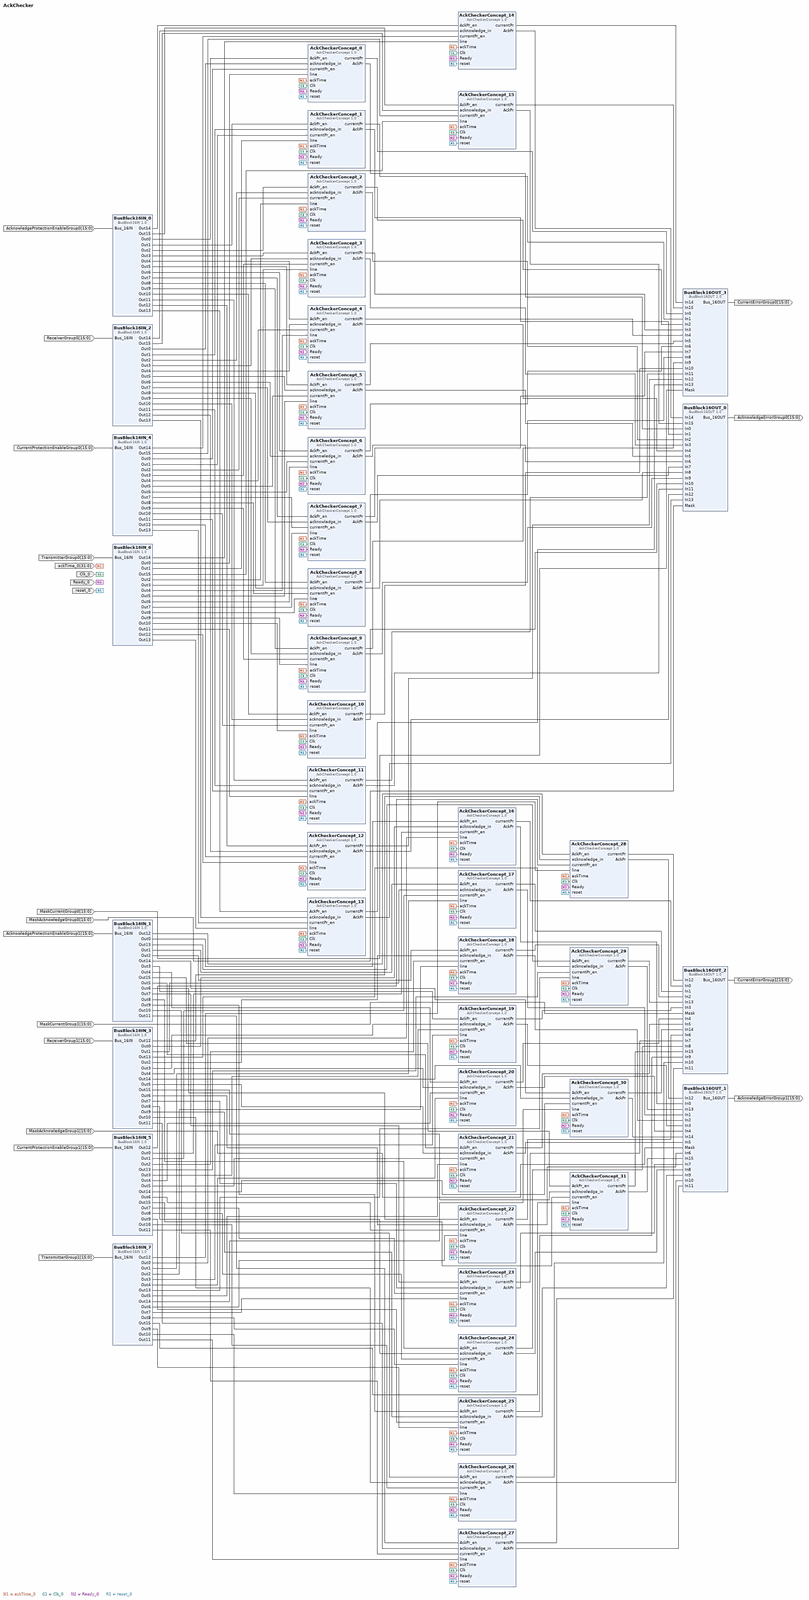
[diagram p0: block diagram of the top level, whole]
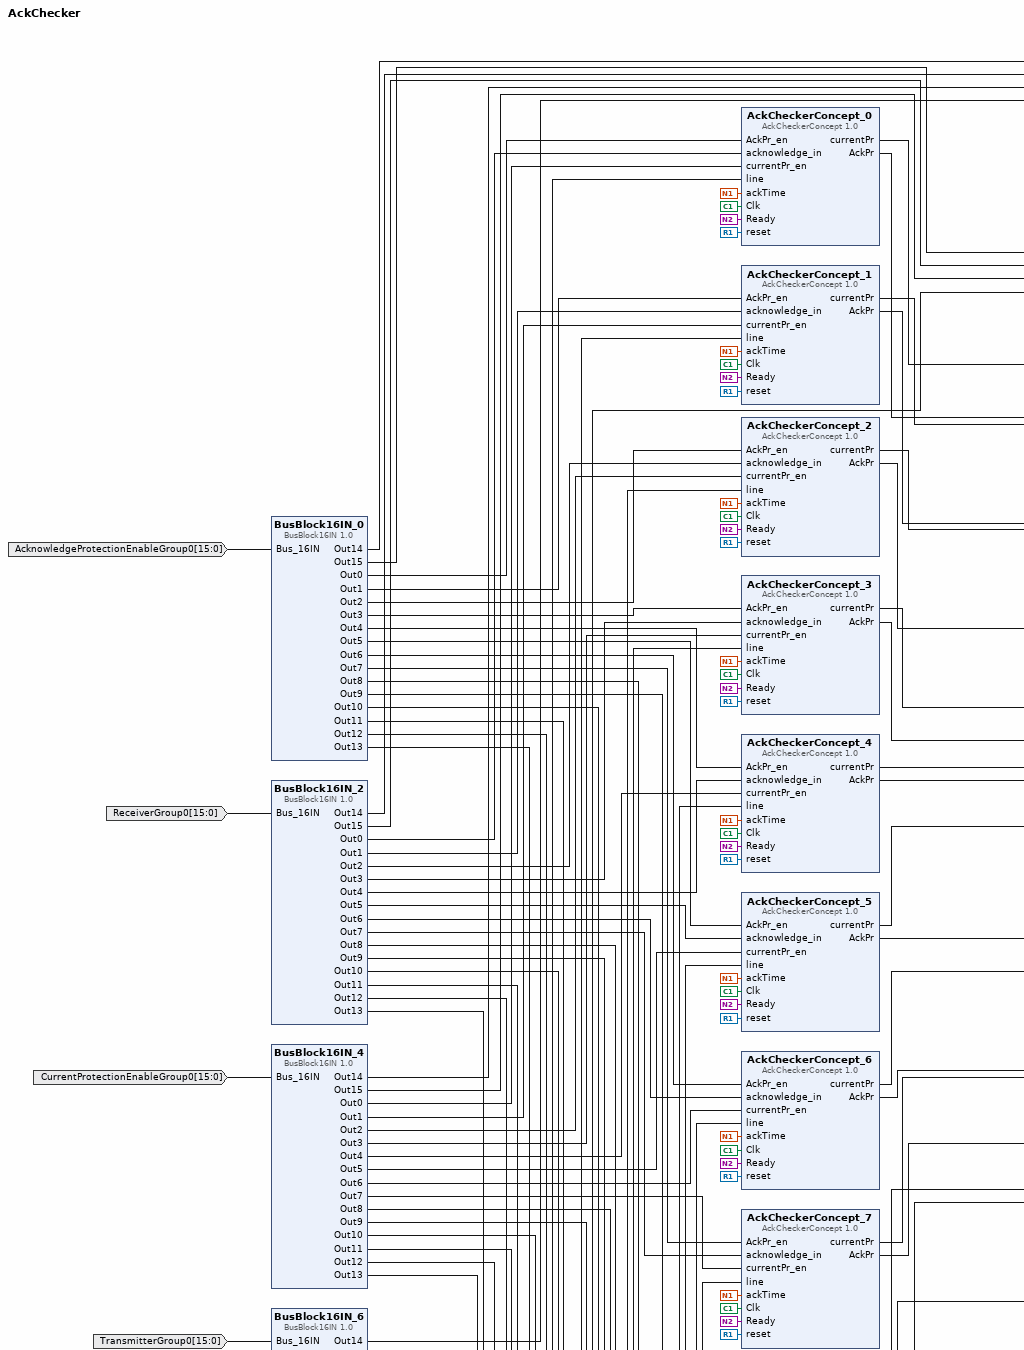
[diagram p1: block diagram of the top level, upper left part]
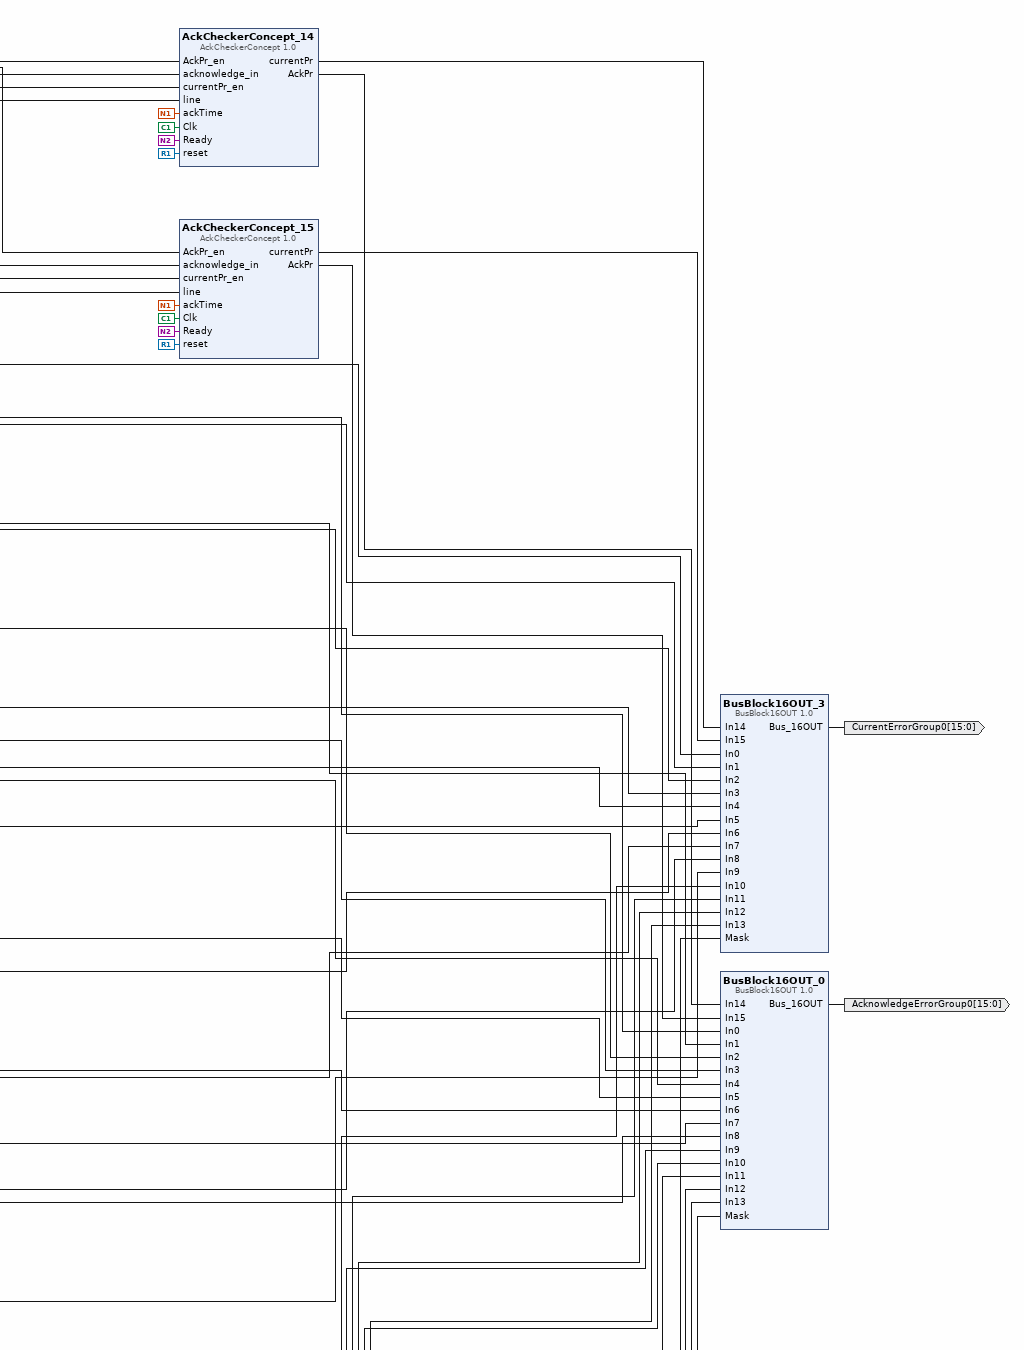
[diagram p2: block diagram of the top level, upper right part]
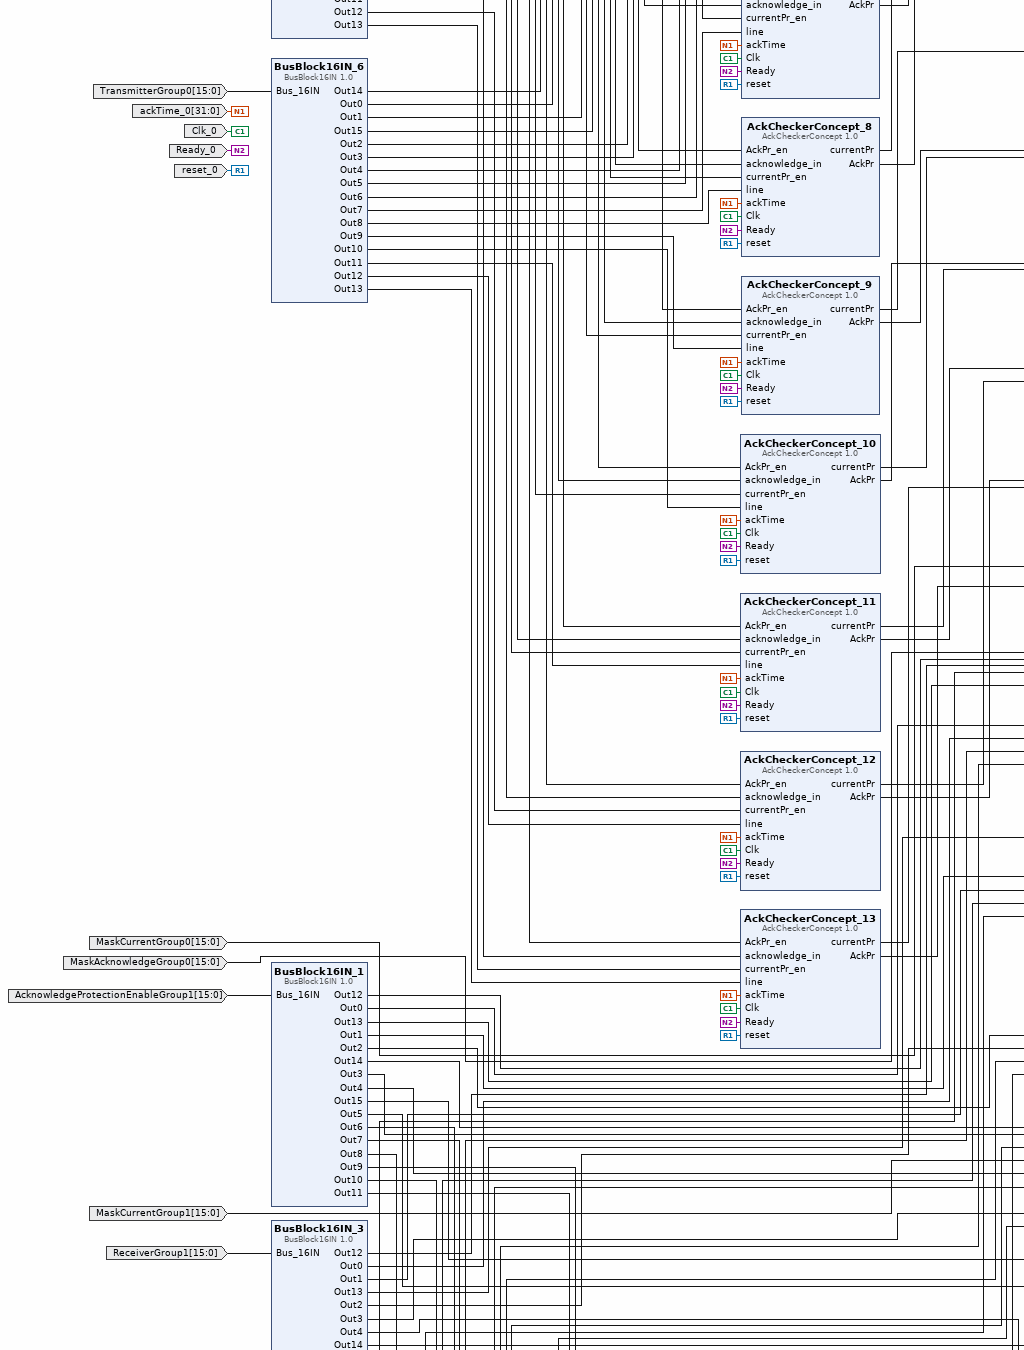
[diagram p3: block diagram of the top level, middle left part]
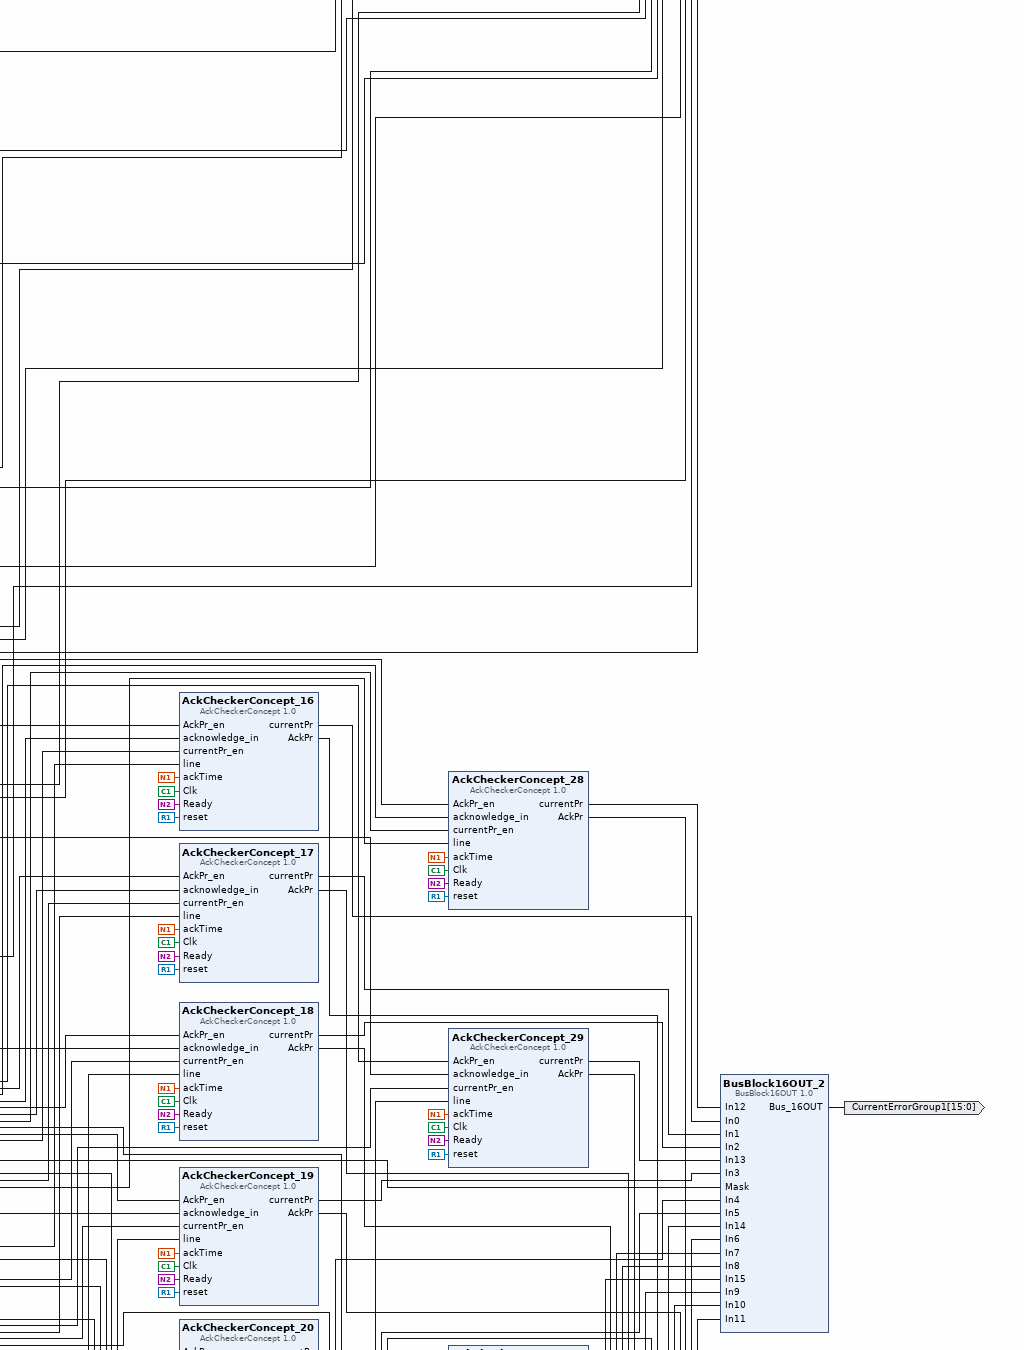
[diagram p4: block diagram of the top level, middle right part]
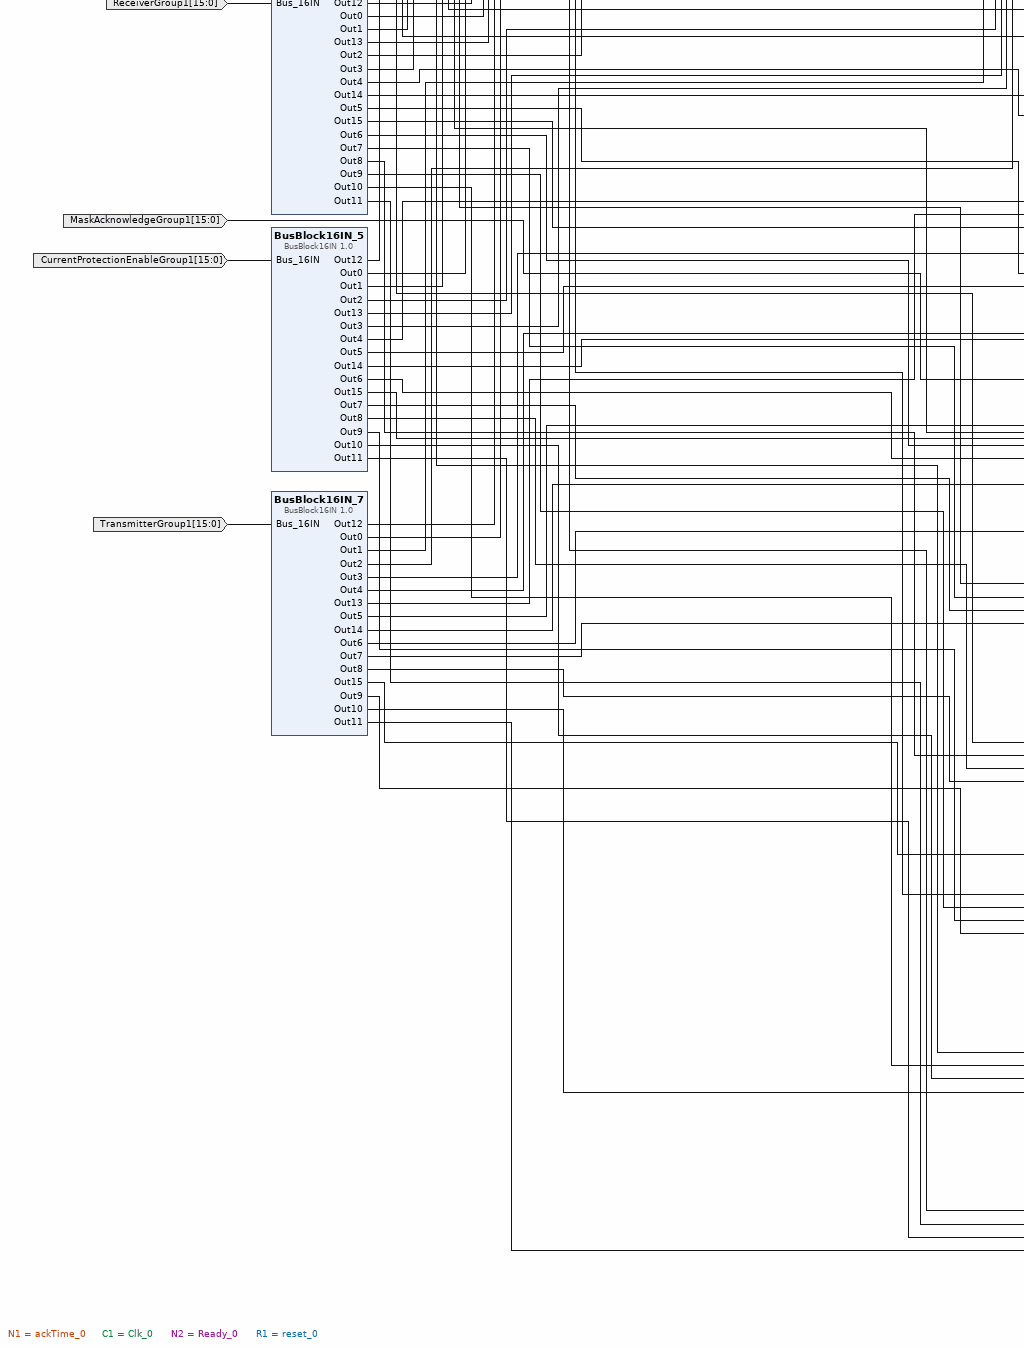
[diagram p5: block diagram of the top level, lower left part]
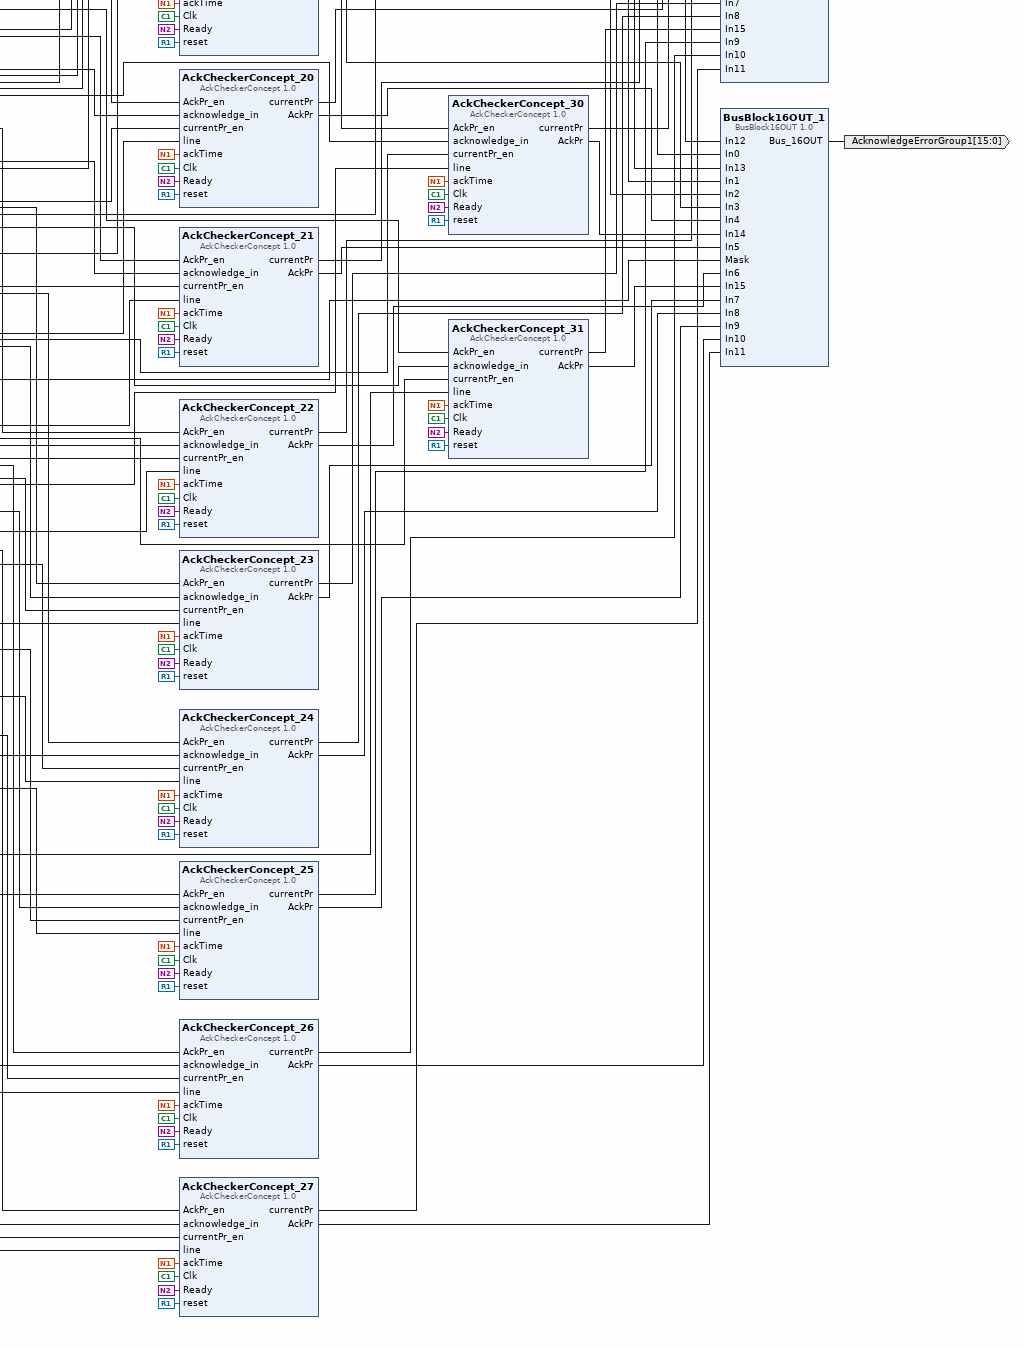
[diagram p6: block diagram of the top level, lower right part]
# Vivado block design AckChecker, xc7z020clg484-3, Vivado 2019.1
create_bd_design AckChecker

create_bd_port -dir I -from 31 -to 0 ackTime_0
create_bd_port -dir I -type clk Clk_0
create_bd_port -dir I Ready_0
create_bd_port -dir I -type rst reset_0
create_bd_port -dir O -from 15 -to 0 AcknowledgeErrorGroup0
create_bd_port -dir O -from 15 -to 0 AcknowledgeErrorGroup1
create_bd_port -dir O -from 15 -to 0 CurrentErrorGroup0
create_bd_port -dir O -from 15 -to 0 CurrentErrorGroup1
create_bd_port -dir I -from 15 -to 0 MaskAcknowledgeGroup0
create_bd_port -dir I -from 15 -to 0 MaskAcknowledgeGroup1
create_bd_port -dir I -from 15 -to 0 MaskCurrentGroup0
create_bd_port -dir I -from 15 -to 0 MaskCurrentGroup1
create_bd_port -dir I -from 15 -to 0 AcknowledgeProtectionEnableGroup0
create_bd_port -dir I -from 15 -to 0 AcknowledgeProtectionEnableGroup1
create_bd_port -dir I -from 15 -to 0 ReceiverGroup0
create_bd_port -dir I -from 15 -to 0 ReceiverGroup1
create_bd_port -dir I -from 15 -to 0 CurrentProtectionEnableGroup0
create_bd_port -dir I -from 15 -to 0 CurrentProtectionEnableGroup1
create_bd_port -dir I -from 15 -to 0 TransmitterGroup0
create_bd_port -dir I -from 15 -to 0 TransmitterGroup1

create_bd_cell -type ip -vlnv ssevendenergy.com:user:AckCheckerConcept:1.0 AckCheckerConcept_0
create_bd_cell -type ip -vlnv ssevendenergy.com:user:AckCheckerConcept:1.0 AckCheckerConcept_1
create_bd_cell -type ip -vlnv ssevendenergy.com:user:AckCheckerConcept:1.0 AckCheckerConcept_2
create_bd_cell -type ip -vlnv ssevendenergy.com:user:AckCheckerConcept:1.0 AckCheckerConcept_3
create_bd_cell -type ip -vlnv ssevendenergy.com:user:AckCheckerConcept:1.0 AckCheckerConcept_4
create_bd_cell -type ip -vlnv ssevendenergy.com:user:AckCheckerConcept:1.0 AckCheckerConcept_5
create_bd_cell -type ip -vlnv ssevendenergy.com:user:AckCheckerConcept:1.0 AckCheckerConcept_6
create_bd_cell -type ip -vlnv ssevendenergy.com:user:AckCheckerConcept:1.0 AckCheckerConcept_7
create_bd_cell -type ip -vlnv ssevendenergy.com:user:AckCheckerConcept:1.0 AckCheckerConcept_8
create_bd_cell -type ip -vlnv ssevendenergy.com:user:AckCheckerConcept:1.0 AckCheckerConcept_9
create_bd_cell -type ip -vlnv ssevendenergy.com:user:AckCheckerConcept:1.0 AckCheckerConcept_10
create_bd_cell -type ip -vlnv ssevendenergy.com:user:AckCheckerConcept:1.0 AckCheckerConcept_11
create_bd_cell -type ip -vlnv ssevendenergy.com:user:AckCheckerConcept:1.0 AckCheckerConcept_12
create_bd_cell -type ip -vlnv ssevendenergy.com:user:AckCheckerConcept:1.0 AckCheckerConcept_13
create_bd_cell -type ip -vlnv ssevendenergy.com:user:AckCheckerConcept:1.0 AckCheckerConcept_14
create_bd_cell -type ip -vlnv ssevendenergy.com:user:AckCheckerConcept:1.0 AckCheckerConcept_15
create_bd_cell -type ip -vlnv ssevendenergy.com:user:AckCheckerConcept:1.0 AckCheckerConcept_16
create_bd_cell -type ip -vlnv ssevendenergy.com:user:AckCheckerConcept:1.0 AckCheckerConcept_17
create_bd_cell -type ip -vlnv ssevendenergy.com:user:AckCheckerConcept:1.0 AckCheckerConcept_18
create_bd_cell -type ip -vlnv ssevendenergy.com:user:AckCheckerConcept:1.0 AckCheckerConcept_19
create_bd_cell -type ip -vlnv ssevendenergy.com:user:AckCheckerConcept:1.0 AckCheckerConcept_20
create_bd_cell -type ip -vlnv ssevendenergy.com:user:AckCheckerConcept:1.0 AckCheckerConcept_21
create_bd_cell -type ip -vlnv ssevendenergy.com:user:AckCheckerConcept:1.0 AckCheckerConcept_22
create_bd_cell -type ip -vlnv ssevendenergy.com:user:AckCheckerConcept:1.0 AckCheckerConcept_23
create_bd_cell -type ip -vlnv ssevendenergy.com:user:AckCheckerConcept:1.0 AckCheckerConcept_24
create_bd_cell -type ip -vlnv ssevendenergy.com:user:AckCheckerConcept:1.0 AckCheckerConcept_25
create_bd_cell -type ip -vlnv ssevendenergy.com:user:AckCheckerConcept:1.0 AckCheckerConcept_26
create_bd_cell -type ip -vlnv ssevendenergy.com:user:AckCheckerConcept:1.0 AckCheckerConcept_27
create_bd_cell -type ip -vlnv ssevendenergy.com:user:AckCheckerConcept:1.0 AckCheckerConcept_28
create_bd_cell -type ip -vlnv ssevendenergy.com:user:AckCheckerConcept:1.0 AckCheckerConcept_29
create_bd_cell -type ip -vlnv ssevendenergy.com:user:AckCheckerConcept:1.0 AckCheckerConcept_30
create_bd_cell -type ip -vlnv ssevendenergy.com:user:AckCheckerConcept:1.0 AckCheckerConcept_31
create_bd_cell -type ip -vlnv ssevendenergy.com:user:BusBlock16OUT:1.0 BusBlock16OUT_0
create_bd_cell -type ip -vlnv ssevendenergy.com:user:BusBlock16OUT:1.0 BusBlock16OUT_1
create_bd_cell -type ip -vlnv ssevendenergy.com:user:BusBlock16OUT:1.0 BusBlock16OUT_2
create_bd_cell -type ip -vlnv ssevendenergy.com:user:BusBlock16OUT:1.0 BusBlock16OUT_3
create_bd_cell -type ip -vlnv ssevendenergy.com:user:BusBlock16IN:1.0 BusBlock16IN_0
create_bd_cell -type ip -vlnv ssevendenergy.com:user:BusBlock16IN:1.0 BusBlock16IN_1
create_bd_cell -type ip -vlnv ssevendenergy.com:user:BusBlock16IN:1.0 BusBlock16IN_2
create_bd_cell -type ip -vlnv ssevendenergy.com:user:BusBlock16IN:1.0 BusBlock16IN_4
create_bd_cell -type ip -vlnv ssevendenergy.com:user:BusBlock16IN:1.0 BusBlock16IN_3
create_bd_cell -type ip -vlnv ssevendenergy.com:user:BusBlock16IN:1.0 BusBlock16IN_5
create_bd_cell -type ip -vlnv ssevendenergy.com:user:BusBlock16IN:1.0 BusBlock16IN_6
create_bd_cell -type ip -vlnv ssevendenergy.com:user:BusBlock16IN:1.0 BusBlock16IN_7

# ---- connections ----

connect_bd_net -net ackTime_0_1 [get_bd_ports ackTime_0] \
  [get_bd_pins AckCheckerConcept_0/ackTime] [get_bd_pins AckCheckerConcept_1/ackTime] \
  [get_bd_pins AckCheckerConcept_4/ackTime] [get_bd_pins AckCheckerConcept_5/ackTime] \
  [get_bd_pins AckCheckerConcept_2/ackTime] [get_bd_pins AckCheckerConcept_6/ackTime] \
  [get_bd_pins AckCheckerConcept_3/ackTime] [get_bd_pins AckCheckerConcept_7/ackTime] \
  [get_bd_pins AckCheckerConcept_8/ackTime] [get_bd_pins AckCheckerConcept_9/ackTime] \
  [get_bd_pins AckCheckerConcept_10/ackTime] [get_bd_pins AckCheckerConcept_11/ackTime] \
  [get_bd_pins AckCheckerConcept_12/ackTime] [get_bd_pins AckCheckerConcept_13/ackTime] \
  [get_bd_pins AckCheckerConcept_14/ackTime] [get_bd_pins AckCheckerConcept_15/ackTime] \
  [get_bd_pins AckCheckerConcept_16/ackTime] [get_bd_pins AckCheckerConcept_17/ackTime] \
  [get_bd_pins AckCheckerConcept_18/ackTime] [get_bd_pins AckCheckerConcept_19/ackTime] \
  [get_bd_pins AckCheckerConcept_20/ackTime] [get_bd_pins AckCheckerConcept_21/ackTime] \
  [get_bd_pins AckCheckerConcept_22/ackTime] [get_bd_pins AckCheckerConcept_23/ackTime] \
  [get_bd_pins AckCheckerConcept_24/ackTime] [get_bd_pins AckCheckerConcept_26/ackTime] \
  [get_bd_pins AckCheckerConcept_27/ackTime] [get_bd_pins AckCheckerConcept_28/ackTime] \
  [get_bd_pins AckCheckerConcept_29/ackTime] [get_bd_pins AckCheckerConcept_30/ackTime] \
  [get_bd_pins AckCheckerConcept_31/ackTime] [get_bd_pins AckCheckerConcept_25/ackTime]
connect_bd_net -net Clk_0_1 [get_bd_ports Clk_0] \
  [get_bd_pins AckCheckerConcept_0/Clk] [get_bd_pins AckCheckerConcept_4/Clk] [get_bd_pins AckCheckerConcept_1/Clk] \
  [get_bd_pins AckCheckerConcept_5/Clk] [get_bd_pins AckCheckerConcept_2/Clk] [get_bd_pins AckCheckerConcept_6/Clk] \
  [get_bd_pins AckCheckerConcept_3/Clk] [get_bd_pins AckCheckerConcept_7/Clk] [get_bd_pins AckCheckerConcept_11/Clk] \
  [get_bd_pins AckCheckerConcept_10/Clk] [get_bd_pins AckCheckerConcept_9/Clk] [get_bd_pins AckCheckerConcept_8/Clk] \
  [get_bd_pins AckCheckerConcept_12/Clk] [get_bd_pins AckCheckerConcept_13/Clk] [get_bd_pins AckCheckerConcept_14/Clk] \
  [get_bd_pins AckCheckerConcept_15/Clk] [get_bd_pins AckCheckerConcept_16/Clk] [get_bd_pins AckCheckerConcept_17/Clk] \
  [get_bd_pins AckCheckerConcept_18/Clk] [get_bd_pins AckCheckerConcept_19/Clk] [get_bd_pins AckCheckerConcept_23/Clk] \
  [get_bd_pins AckCheckerConcept_22/Clk] [get_bd_pins AckCheckerConcept_21/Clk] [get_bd_pins AckCheckerConcept_20/Clk] \
  [get_bd_pins AckCheckerConcept_24/Clk] [get_bd_pins AckCheckerConcept_25/Clk] [get_bd_pins AckCheckerConcept_26/Clk] \
  [get_bd_pins AckCheckerConcept_27/Clk] [get_bd_pins AckCheckerConcept_31/Clk] [get_bd_pins AckCheckerConcept_30/Clk] \
  [get_bd_pins AckCheckerConcept_29/Clk] [get_bd_pins AckCheckerConcept_28/Clk]
connect_bd_net -net Ready_0_1 [get_bd_ports Ready_0] \
  [get_bd_pins AckCheckerConcept_0/Ready] [get_bd_pins AckCheckerConcept_1/Ready] [get_bd_pins AckCheckerConcept_2/Ready] \
  [get_bd_pins AckCheckerConcept_3/Ready] [get_bd_pins AckCheckerConcept_4/Ready] [get_bd_pins AckCheckerConcept_5/Ready] \
  [get_bd_pins AckCheckerConcept_6/Ready] [get_bd_pins AckCheckerConcept_7/Ready] [get_bd_pins AckCheckerConcept_11/Ready] \
  [get_bd_pins AckCheckerConcept_10/Ready] [get_bd_pins AckCheckerConcept_9/Ready] [get_bd_pins AckCheckerConcept_8/Ready] \
  [get_bd_pins AckCheckerConcept_12/Ready] [get_bd_pins AckCheckerConcept_13/Ready] [get_bd_pins AckCheckerConcept_14/Ready] \
  [get_bd_pins AckCheckerConcept_15/Ready] [get_bd_pins AckCheckerConcept_16/Ready] [get_bd_pins AckCheckerConcept_17/Ready] \
  [get_bd_pins AckCheckerConcept_18/Ready] [get_bd_pins AckCheckerConcept_19/Ready] [get_bd_pins AckCheckerConcept_23/Ready] \
  [get_bd_pins AckCheckerConcept_22/Ready] [get_bd_pins AckCheckerConcept_21/Ready] [get_bd_pins AckCheckerConcept_20/Ready] \
  [get_bd_pins AckCheckerConcept_24/Ready] [get_bd_pins AckCheckerConcept_25/Ready] [get_bd_pins AckCheckerConcept_26/Ready] \
  [get_bd_pins AckCheckerConcept_27/Ready] [get_bd_pins AckCheckerConcept_31/Ready] [get_bd_pins AckCheckerConcept_30/Ready] \
  [get_bd_pins AckCheckerConcept_29/Ready] [get_bd_pins AckCheckerConcept_28/Ready]
connect_bd_net -net reset_0_1 [get_bd_ports reset_0] \
  [get_bd_pins AckCheckerConcept_0/reset] [get_bd_pins AckCheckerConcept_1/reset] [get_bd_pins AckCheckerConcept_2/reset] \
  [get_bd_pins AckCheckerConcept_3/reset] [get_bd_pins AckCheckerConcept_7/reset] [get_bd_pins AckCheckerConcept_6/reset] \
  [get_bd_pins AckCheckerConcept_5/reset] [get_bd_pins AckCheckerConcept_4/reset] [get_bd_pins AckCheckerConcept_8/reset] \
  [get_bd_pins AckCheckerConcept_9/reset] [get_bd_pins AckCheckerConcept_10/reset] [get_bd_pins AckCheckerConcept_11/reset] \
  [get_bd_pins AckCheckerConcept_14/reset] [get_bd_pins AckCheckerConcept_15/reset] [get_bd_pins AckCheckerConcept_13/reset] \
  [get_bd_pins AckCheckerConcept_12/reset] [get_bd_pins AckCheckerConcept_19/reset] [get_bd_pins AckCheckerConcept_18/reset] \
  [get_bd_pins AckCheckerConcept_17/reset] [get_bd_pins AckCheckerConcept_16/reset] [get_bd_pins AckCheckerConcept_20/reset] \
  [get_bd_pins AckCheckerConcept_21/reset] [get_bd_pins AckCheckerConcept_22/reset] [get_bd_pins AckCheckerConcept_23/reset] \
  [get_bd_pins AckCheckerConcept_27/reset] [get_bd_pins AckCheckerConcept_26/reset] [get_bd_pins AckCheckerConcept_25/reset] \
  [get_bd_pins AckCheckerConcept_24/reset] [get_bd_pins AckCheckerConcept_28/reset] [get_bd_pins AckCheckerConcept_29/reset] \
  [get_bd_pins AckCheckerConcept_30/reset] [get_bd_pins AckCheckerConcept_31/reset]
connect_bd_net [get_bd_pins AckCheckerConcept_0/AckPr] [get_bd_pins BusBlock16OUT_0/In0]
connect_bd_net [get_bd_pins AckCheckerConcept_1/AckPr] [get_bd_pins BusBlock16OUT_0/In1]
connect_bd_net [get_bd_pins AckCheckerConcept_2/AckPr] [get_bd_pins BusBlock16OUT_0/In2]
connect_bd_net [get_bd_pins AckCheckerConcept_3/AckPr] [get_bd_pins BusBlock16OUT_0/In3]
connect_bd_net [get_bd_pins AckCheckerConcept_4/AckPr] [get_bd_pins BusBlock16OUT_0/In4]
connect_bd_net [get_bd_pins AckCheckerConcept_5/AckPr] [get_bd_pins BusBlock16OUT_0/In5]
connect_bd_net [get_bd_pins AckCheckerConcept_6/AckPr] [get_bd_pins BusBlock16OUT_0/In6]
connect_bd_net [get_bd_pins AckCheckerConcept_7/AckPr] [get_bd_pins BusBlock16OUT_0/In7]
connect_bd_net [get_bd_pins AckCheckerConcept_8/AckPr] [get_bd_pins BusBlock16OUT_0/In8]
connect_bd_net [get_bd_pins AckCheckerConcept_9/AckPr] [get_bd_pins BusBlock16OUT_0/In9]
connect_bd_net [get_bd_pins AckCheckerConcept_10/AckPr] [get_bd_pins BusBlock16OUT_0/In10]
connect_bd_net [get_bd_pins AckCheckerConcept_11/AckPr] [get_bd_pins BusBlock16OUT_0/In11]
connect_bd_net [get_bd_pins AckCheckerConcept_12/AckPr] [get_bd_pins BusBlock16OUT_0/In12]
connect_bd_net [get_bd_pins AckCheckerConcept_13/AckPr] [get_bd_pins BusBlock16OUT_0/In13]
connect_bd_net [get_bd_pins AckCheckerConcept_14/AckPr] [get_bd_pins BusBlock16OUT_0/In14]
connect_bd_net [get_bd_pins AckCheckerConcept_15/AckPr] [get_bd_pins BusBlock16OUT_0/In15]
connect_bd_net [get_bd_pins AckCheckerConcept_16/AckPr] [get_bd_pins BusBlock16OUT_1/In0]
connect_bd_net [get_bd_pins AckCheckerConcept_17/AckPr] [get_bd_pins BusBlock16OUT_1/In1]
connect_bd_net [get_bd_pins AckCheckerConcept_18/AckPr] [get_bd_pins BusBlock16OUT_1/In2]
connect_bd_net [get_bd_pins AckCheckerConcept_19/AckPr] [get_bd_pins BusBlock16OUT_1/In3]
connect_bd_net [get_bd_pins AckCheckerConcept_20/AckPr] [get_bd_pins BusBlock16OUT_1/In4]
connect_bd_net [get_bd_pins AckCheckerConcept_21/AckPr] [get_bd_pins BusBlock16OUT_1/In5]
connect_bd_net [get_bd_pins AckCheckerConcept_22/AckPr] [get_bd_pins BusBlock16OUT_1/In6]
connect_bd_net [get_bd_pins AckCheckerConcept_23/AckPr] [get_bd_pins BusBlock16OUT_1/In7]
connect_bd_net [get_bd_pins AckCheckerConcept_24/AckPr] [get_bd_pins BusBlock16OUT_1/In8]
connect_bd_net [get_bd_pins AckCheckerConcept_25/AckPr] [get_bd_pins BusBlock16OUT_1/In9]
connect_bd_net [get_bd_pins AckCheckerConcept_26/AckPr] [get_bd_pins BusBlock16OUT_1/In10]
connect_bd_net [get_bd_pins AckCheckerConcept_27/AckPr] [get_bd_pins BusBlock16OUT_1/In11]
connect_bd_net [get_bd_pins AckCheckerConcept_28/AckPr] [get_bd_pins BusBlock16OUT_1/In12]
connect_bd_net [get_bd_pins AckCheckerConcept_29/AckPr] [get_bd_pins BusBlock16OUT_1/In13]
connect_bd_net [get_bd_pins AckCheckerConcept_30/AckPr] [get_bd_pins BusBlock16OUT_1/In14]
connect_bd_net [get_bd_pins AckCheckerConcept_31/AckPr] [get_bd_pins BusBlock16OUT_1/In15]
connect_bd_net [get_bd_pins AckCheckerConcept_0/currentPr] [get_bd_pins BusBlock16OUT_3/In0]
connect_bd_net [get_bd_pins AckCheckerConcept_1/currentPr] [get_bd_pins BusBlock16OUT_3/In1]
connect_bd_net [get_bd_pins AckCheckerConcept_2/currentPr] [get_bd_pins BusBlock16OUT_3/In2]
connect_bd_net [get_bd_pins AckCheckerConcept_3/currentPr] [get_bd_pins BusBlock16OUT_3/In3]
connect_bd_net [get_bd_pins AckCheckerConcept_4/currentPr] [get_bd_pins BusBlock16OUT_3/In4]
connect_bd_net [get_bd_pins AckCheckerConcept_5/currentPr] [get_bd_pins BusBlock16OUT_3/In5]
connect_bd_net [get_bd_pins AckCheckerConcept_6/currentPr] [get_bd_pins BusBlock16OUT_3/In6]
connect_bd_net [get_bd_pins AckCheckerConcept_7/currentPr] [get_bd_pins BusBlock16OUT_3/In7]
connect_bd_net [get_bd_pins AckCheckerConcept_8/currentPr] [get_bd_pins BusBlock16OUT_3/In8]
connect_bd_net [get_bd_pins AckCheckerConcept_9/currentPr] [get_bd_pins BusBlock16OUT_3/In9]
connect_bd_net [get_bd_pins AckCheckerConcept_10/currentPr] [get_bd_pins BusBlock16OUT_3/In10]
connect_bd_net [get_bd_pins AckCheckerConcept_11/currentPr] [get_bd_pins BusBlock16OUT_3/In11]
connect_bd_net [get_bd_pins AckCheckerConcept_12/currentPr] [get_bd_pins BusBlock16OUT_3/In12]
connect_bd_net [get_bd_pins AckCheckerConcept_13/currentPr] [get_bd_pins BusBlock16OUT_3/In13]
connect_bd_net [get_bd_pins AckCheckerConcept_14/currentPr] [get_bd_pins BusBlock16OUT_3/In14]
connect_bd_net [get_bd_pins AckCheckerConcept_15/currentPr] [get_bd_pins BusBlock16OUT_3/In15]
connect_bd_net [get_bd_pins AckCheckerConcept_16/currentPr] [get_bd_pins BusBlock16OUT_2/In0]
connect_bd_net [get_bd_pins AckCheckerConcept_17/currentPr] [get_bd_pins BusBlock16OUT_2/In1]
connect_bd_net [get_bd_pins AckCheckerConcept_18/currentPr] [get_bd_pins BusBlock16OUT_2/In2]
connect_bd_net [get_bd_pins AckCheckerConcept_19/currentPr] [get_bd_pins BusBlock16OUT_2/In3]
connect_bd_net [get_bd_pins AckCheckerConcept_20/currentPr] [get_bd_pins BusBlock16OUT_2/In4]
connect_bd_net [get_bd_pins AckCheckerConcept_21/currentPr] [get_bd_pins BusBlock16OUT_2/In5]
connect_bd_net [get_bd_pins AckCheckerConcept_22/currentPr] [get_bd_pins BusBlock16OUT_2/In6]
connect_bd_net [get_bd_pins AckCheckerConcept_23/currentPr] [get_bd_pins BusBlock16OUT_2/In7]
connect_bd_net [get_bd_pins AckCheckerConcept_24/currentPr] [get_bd_pins BusBlock16OUT_2/In8]
connect_bd_net [get_bd_pins AckCheckerConcept_25/currentPr] [get_bd_pins BusBlock16OUT_2/In9]
connect_bd_net [get_bd_pins AckCheckerConcept_26/currentPr] [get_bd_pins BusBlock16OUT_2/In10]
connect_bd_net [get_bd_pins AckCheckerConcept_27/currentPr] [get_bd_pins BusBlock16OUT_2/In11]
connect_bd_net [get_bd_pins AckCheckerConcept_28/currentPr] [get_bd_pins BusBlock16OUT_2/In12]
connect_bd_net [get_bd_pins AckCheckerConcept_29/currentPr] [get_bd_pins BusBlock16OUT_2/In13]
connect_bd_net [get_bd_pins AckCheckerConcept_30/currentPr] [get_bd_pins BusBlock16OUT_2/In14]
connect_bd_net [get_bd_pins AckCheckerConcept_31/currentPr] [get_bd_pins BusBlock16OUT_2/In15]
connect_bd_net -net BusBlock16OUT_0_BusBlock16OUT [get_bd_pins BusBlock16OUT_0/Bus_16OUT] [get_bd_ports AcknowledgeErrorGroup0]
connect_bd_net -net BusBlock16OUT_1_BusBlock16OUT [get_bd_pins BusBlock16OUT_1/Bus_16OUT] [get_bd_ports AcknowledgeErrorGroup1]
connect_bd_net -net BusBlock16OUT_3_BusBlock16OUT [get_bd_pins BusBlock16OUT_3/Bus_16OUT] [get_bd_ports CurrentErrorGroup0]
connect_bd_net -net BusBlock16OUT_2_BusBlock16OUT [get_bd_pins BusBlock16OUT_2/Bus_16OUT] [get_bd_ports CurrentErrorGroup1]
connect_bd_net -net MaskAcknowledgeGroup0_1 [get_bd_ports MaskAcknowledgeGroup0] [get_bd_pins BusBlock16OUT_0/Mask]
connect_bd_net -net MaskAcknowledgeGroup1_1 [get_bd_ports MaskAcknowledgeGroup1] [get_bd_pins BusBlock16OUT_1/Mask]
connect_bd_net -net MaskCurrentGroup0_1 [get_bd_ports MaskCurrentGroup0] [get_bd_pins BusBlock16OUT_3/Mask]
connect_bd_net -net MaskCurrentGroup1_1 [get_bd_ports MaskCurrentGroup1] [get_bd_pins BusBlock16OUT_2/Mask]
connect_bd_net [get_bd_pins BusBlock16IN_0/Out0] [get_bd_pins AckCheckerConcept_0/AckPr_en]
connect_bd_net [get_bd_pins BusBlock16IN_0/Out1] [get_bd_pins AckCheckerConcept_1/AckPr_en]
connect_bd_net [get_bd_pins BusBlock16IN_0/Out2] [get_bd_pins AckCheckerConcept_2/AckPr_en]
connect_bd_net [get_bd_pins BusBlock16IN_0/Out3] [get_bd_pins AckCheckerConcept_3/AckPr_en]
connect_bd_net [get_bd_pins BusBlock16IN_0/Out4] [get_bd_pins AckCheckerConcept_4/AckPr_en]
connect_bd_net [get_bd_pins BusBlock16IN_0/Out5] [get_bd_pins AckCheckerConcept_5/AckPr_en]
connect_bd_net [get_bd_pins BusBlock16IN_0/Out6] [get_bd_pins AckCheckerConcept_6/AckPr_en]
connect_bd_net [get_bd_pins BusBlock16IN_0/Out7] [get_bd_pins AckCheckerConcept_7/AckPr_en]
connect_bd_net [get_bd_pins BusBlock16IN_0/Out8] [get_bd_pins AckCheckerConcept_8/AckPr_en]
connect_bd_net [get_bd_pins BusBlock16IN_0/Out9] [get_bd_pins AckCheckerConcept_9/AckPr_en]
connect_bd_net [get_bd_pins BusBlock16IN_0/Out10] [get_bd_pins AckCheckerConcept_10/AckPr_en]
connect_bd_net [get_bd_pins BusBlock16IN_0/Out11] [get_bd_pins AckCheckerConcept_11/AckPr_en]
connect_bd_net [get_bd_pins BusBlock16IN_0/Out12] [get_bd_pins AckCheckerConcept_12/AckPr_en]
connect_bd_net [get_bd_pins BusBlock16IN_0/Out13] [get_bd_pins AckCheckerConcept_13/AckPr_en]
connect_bd_net [get_bd_pins BusBlock16IN_0/Out14] [get_bd_pins AckCheckerConcept_14/AckPr_en]
connect_bd_net [get_bd_pins BusBlock16IN_0/Out15] [get_bd_pins AckCheckerConcept_15/AckPr_en]
connect_bd_net [get_bd_pins BusBlock16IN_1/Out0] [get_bd_pins AckCheckerConcept_16/AckPr_en]
connect_bd_net [get_bd_pins BusBlock16IN_1/Out1] [get_bd_pins AckCheckerConcept_17/AckPr_en]
connect_bd_net [get_bd_pins BusBlock16IN_1/Out2] [get_bd_pins AckCheckerConcept_18/AckPr_en]
connect_bd_net [get_bd_pins BusBlock16IN_1/Out3] [get_bd_pins AckCheckerConcept_19/AckPr_en]
connect_bd_net [get_bd_pins BusBlock16IN_1/Out4] [get_bd_pins AckCheckerConcept_20/AckPr_en]
connect_bd_net [get_bd_pins BusBlock16IN_1/Out5] [get_bd_pins AckCheckerConcept_21/AckPr_en]
connect_bd_net [get_bd_pins BusBlock16IN_1/Out6] [get_bd_pins AckCheckerConcept_22/AckPr_en]
connect_bd_net [get_bd_pins BusBlock16IN_1/Out7] [get_bd_pins AckCheckerConcept_23/AckPr_en]
connect_bd_net [get_bd_pins BusBlock16IN_1/Out8] [get_bd_pins AckCheckerConcept_24/AckPr_en]
connect_bd_net [get_bd_pins BusBlock16IN_1/Out9] [get_bd_pins AckCheckerConcept_25/AckPr_en]
connect_bd_net [get_bd_pins BusBlock16IN_1/Out10] [get_bd_pins AckCheckerConcept_26/AckPr_en]
connect_bd_net [get_bd_pins BusBlock16IN_1/Out11] [get_bd_pins AckCheckerConcept_27/AckPr_en]
connect_bd_net [get_bd_pins BusBlock16IN_1/Out12] [get_bd_pins AckCheckerConcept_28/AckPr_en]
connect_bd_net [get_bd_pins BusBlock16IN_1/Out13] [get_bd_pins AckCheckerConcept_29/AckPr_en]
connect_bd_net [get_bd_pins BusBlock16IN_1/Out14] [get_bd_pins AckCheckerConcept_30/AckPr_en]
connect_bd_net [get_bd_pins BusBlock16IN_1/Out15] [get_bd_pins AckCheckerConcept_31/AckPr_en]
connect_bd_net -net AcknowledgeProtectionEnableGroup0_1 [get_bd_ports AcknowledgeProtectionEnableGroup0] [get_bd_pins BusBlock16IN_0/Bus_16IN]
connect_bd_net -net AcknowledgeProtectionEnableGroup1_1 [get_bd_ports AcknowledgeProtectionEnableGroup1] [get_bd_pins BusBlock16IN_1/Bus_16IN]
connect_bd_net [get_bd_pins BusBlock16IN_2/Out0] [get_bd_pins AckCheckerConcept_0/acknowledge_in]
connect_bd_net [get_bd_pins BusBlock16IN_2/Out1] [get_bd_pins AckCheckerConcept_1/acknowledge_in]
connect_bd_net [get_bd_pins BusBlock16IN_2/Out2] [get_bd_pins AckCheckerConcept_2/acknowledge_in]
connect_bd_net [get_bd_pins BusBlock16IN_2/Out3] [get_bd_pins AckCheckerConcept_3/acknowledge_in]
connect_bd_net [get_bd_pins BusBlock16IN_2/Out4] [get_bd_pins AckCheckerConcept_4/acknowledge_in]
connect_bd_net [get_bd_pins BusBlock16IN_2/Out5] [get_bd_pins AckCheckerConcept_5/acknowledge_in]
connect_bd_net [get_bd_pins BusBlock16IN_2/Out6] [get_bd_pins AckCheckerConcept_6/acknowledge_in]
connect_bd_net [get_bd_pins BusBlock16IN_2/Out7] [get_bd_pins AckCheckerConcept_7/acknowledge_in]
connect_bd_net [get_bd_pins BusBlock16IN_2/Out8] [get_bd_pins AckCheckerConcept_8/acknowledge_in]
connect_bd_net [get_bd_pins BusBlock16IN_2/Out9] [get_bd_pins AckCheckerConcept_9/acknowledge_in]
connect_bd_net [get_bd_pins BusBlock16IN_2/Out10] [get_bd_pins AckCheckerConcept_10/acknowledge_in]
connect_bd_net [get_bd_pins BusBlock16IN_2/Out11] [get_bd_pins AckCheckerConcept_11/acknowledge_in]
connect_bd_net [get_bd_pins BusBlock16IN_2/Out12] [get_bd_pins AckCheckerConcept_12/acknowledge_in]
connect_bd_net [get_bd_pins BusBlock16IN_2/Out13] [get_bd_pins AckCheckerConcept_13/acknowledge_in]
connect_bd_net [get_bd_pins BusBlock16IN_2/Out14] [get_bd_pins AckCheckerConcept_14/acknowledge_in]
connect_bd_net [get_bd_pins BusBlock16IN_2/Out15] [get_bd_pins AckCheckerConcept_15/acknowledge_in]
connect_bd_net [get_bd_pins BusBlock16IN_3/Out0] [get_bd_pins AckCheckerConcept_16/acknowledge_in]
connect_bd_net [get_bd_pins BusBlock16IN_3/Out1] [get_bd_pins AckCheckerConcept_17/acknowledge_in]
connect_bd_net [get_bd_pins BusBlock16IN_3/Out2] [get_bd_pins AckCheckerConcept_18/acknowledge_in]
connect_bd_net [get_bd_pins BusBlock16IN_3/Out3] [get_bd_pins AckCheckerConcept_19/acknowledge_in]
connect_bd_net [get_bd_pins BusBlock16IN_3/Out4] [get_bd_pins AckCheckerConcept_20/acknowledge_in]
connect_bd_net [get_bd_pins BusBlock16IN_3/Out5] [get_bd_pins AckCheckerConcept_21/acknowledge_in]
connect_bd_net [get_bd_pins BusBlock16IN_3/Out6] [get_bd_pins AckCheckerConcept_22/acknowledge_in]
connect_bd_net [get_bd_pins BusBlock16IN_3/Out7] [get_bd_pins AckCheckerConcept_23/acknowledge_in]
connect_bd_net [get_bd_pins BusBlock16IN_3/Out8] [get_bd_pins AckCheckerConcept_24/acknowledge_in]
connect_bd_net [get_bd_pins BusBlock16IN_3/Out9] [get_bd_pins AckCheckerConcept_25/acknowledge_in]
connect_bd_net [get_bd_pins BusBlock16IN_3/Out10] [get_bd_pins AckCheckerConcept_26/acknowledge_in]
connect_bd_net [get_bd_pins BusBlock16IN_3/Out11] [get_bd_pins AckCheckerConcept_27/acknowledge_in]
connect_bd_net [get_bd_pins BusBlock16IN_3/Out12] [get_bd_pins AckCheckerConcept_28/acknowledge_in]
connect_bd_net [get_bd_pins BusBlock16IN_3/Out13] [get_bd_pins AckCheckerConcept_29/acknowledge_in]
connect_bd_net [get_bd_pins BusBlock16IN_3/Out14] [get_bd_pins AckCheckerConcept_30/acknowledge_in]
connect_bd_net [get_bd_pins BusBlock16IN_3/Out15] [get_bd_pins AckCheckerConcept_31/acknowledge_in]
connect_bd_net -net ReceiverGroup0_1 [get_bd_ports ReceiverGroup0] [get_bd_pins BusBlock16IN_2/Bus_16IN]
connect_bd_net -net ReceiverGroup1_1 [get_bd_ports ReceiverGroup1] [get_bd_pins BusBlock16IN_3/Bus_16IN]
connect_bd_net [get_bd_pins BusBlock16IN_4/Out0] [get_bd_pins AckCheckerConcept_0/currentPr_en]
connect_bd_net [get_bd_pins BusBlock16IN_4/Out1] [get_bd_pins AckCheckerConcept_1/currentPr_en]
connect_bd_net [get_bd_pins BusBlock16IN_4/Out2] [get_bd_pins AckCheckerConcept_2/currentPr_en]
connect_bd_net [get_bd_pins BusBlock16IN_4/Out3] [get_bd_pins AckCheckerConcept_3/currentPr_en]
connect_bd_net [get_bd_pins BusBlock16IN_4/Out4] [get_bd_pins AckCheckerConcept_4/currentPr_en]
connect_bd_net [get_bd_pins BusBlock16IN_4/Out5] [get_bd_pins AckCheckerConcept_5/currentPr_en]
connect_bd_net [get_bd_pins BusBlock16IN_4/Out6] [get_bd_pins AckCheckerConcept_6/currentPr_en]
connect_bd_net [get_bd_pins BusBlock16IN_4/Out7] [get_bd_pins AckCheckerConcept_7/currentPr_en]
connect_bd_net [get_bd_pins BusBlock16IN_4/Out8] [get_bd_pins AckCheckerConcept_8/currentPr_en]
connect_bd_net [get_bd_pins BusBlock16IN_4/Out9] [get_bd_pins AckCheckerConcept_9/currentPr_en]
connect_bd_net [get_bd_pins BusBlock16IN_4/Out10] [get_bd_pins AckCheckerConcept_10/currentPr_en]
connect_bd_net [get_bd_pins BusBlock16IN_4/Out11] [get_bd_pins AckCheckerConcept_11/currentPr_en]
connect_bd_net [get_bd_pins BusBlock16IN_4/Out12] [get_bd_pins AckCheckerConcept_12/currentPr_en]
connect_bd_net [get_bd_pins BusBlock16IN_4/Out13] [get_bd_pins AckCheckerConcept_13/currentPr_en]
connect_bd_net [get_bd_pins BusBlock16IN_4/Out14] [get_bd_pins AckCheckerConcept_14/currentPr_en]
connect_bd_net [get_bd_pins BusBlock16IN_4/Out15] [get_bd_pins AckCheckerConcept_15/currentPr_en]
connect_bd_net [get_bd_pins BusBlock16IN_5/Out0] [get_bd_pins AckCheckerConcept_16/currentPr_en]
connect_bd_net [get_bd_pins BusBlock16IN_5/Out1] [get_bd_pins AckCheckerConcept_17/currentPr_en]
connect_bd_net [get_bd_pins BusBlock16IN_5/Out2] [get_bd_pins AckCheckerConcept_18/currentPr_en]
connect_bd_net [get_bd_pins BusBlock16IN_5/Out3] [get_bd_pins AckCheckerConcept_19/currentPr_en]
connect_bd_net [get_bd_pins BusBlock16IN_5/Out4] [get_bd_pins AckCheckerConcept_20/currentPr_en]
connect_bd_net [get_bd_pins BusBlock16IN_5/Out5] [get_bd_pins AckCheckerConcept_21/currentPr_en]
connect_bd_net [get_bd_pins BusBlock16IN_5/Out6] [get_bd_pins AckCheckerConcept_22/currentPr_en]
connect_bd_net [get_bd_pins BusBlock16IN_5/Out7] [get_bd_pins AckCheckerConcept_23/currentPr_en]
connect_bd_net [get_bd_pins BusBlock16IN_5/Out8] [get_bd_pins AckCheckerConcept_24/currentPr_en]
connect_bd_net [get_bd_pins BusBlock16IN_5/Out9] [get_bd_pins AckCheckerConcept_25/currentPr_en]
connect_bd_net [get_bd_pins BusBlock16IN_5/Out10] [get_bd_pins AckCheckerConcept_26/currentPr_en]
connect_bd_net [get_bd_pins BusBlock16IN_5/Out11] [get_bd_pins AckCheckerConcept_27/currentPr_en]
connect_bd_net [get_bd_pins BusBlock16IN_5/Out12] [get_bd_pins AckCheckerConcept_28/currentPr_en]
connect_bd_net [get_bd_pins BusBlock16IN_5/Out13] [get_bd_pins AckCheckerConcept_29/currentPr_en]
connect_bd_net [get_bd_pins BusBlock16IN_5/Out14] [get_bd_pins AckCheckerConcept_30/currentPr_en]
connect_bd_net [get_bd_pins BusBlock16IN_5/Out15] [get_bd_pins AckCheckerConcept_31/currentPr_en]
connect_bd_net -net CurrentProtectionEnableGroup0_1 [get_bd_ports CurrentProtectionEnableGroup0] [get_bd_pins BusBlock16IN_4/Bus_16IN]
connect_bd_net -net CurrentProtectionEnableGroup1_1 [get_bd_ports CurrentProtectionEnableGroup1] [get_bd_pins BusBlock16IN_5/Bus_16IN]
connect_bd_net [get_bd_pins BusBlock16IN_6/Out0] [get_bd_pins AckCheckerConcept_0/line]
connect_bd_net [get_bd_pins BusBlock16IN_6/Out1] [get_bd_pins AckCheckerConcept_1/line]
connect_bd_net [get_bd_pins BusBlock16IN_6/Out2] [get_bd_pins AckCheckerConcept_2/line]
connect_bd_net [get_bd_pins BusBlock16IN_6/Out3] [get_bd_pins AckCheckerConcept_3/line]
connect_bd_net [get_bd_pins BusBlock16IN_6/Out4] [get_bd_pins AckCheckerConcept_4/line]
connect_bd_net [get_bd_pins BusBlock16IN_6/Out5] [get_bd_pins AckCheckerConcept_5/line]
connect_bd_net [get_bd_pins BusBlock16IN_6/Out6] [get_bd_pins AckCheckerConcept_6/line]
connect_bd_net [get_bd_pins BusBlock16IN_6/Out7] [get_bd_pins AckCheckerConcept_7/line]
connect_bd_net [get_bd_pins BusBlock16IN_6/Out8] [get_bd_pins AckCheckerConcept_8/line]
connect_bd_net [get_bd_pins BusBlock16IN_6/Out9] [get_bd_pins AckCheckerConcept_9/line]
connect_bd_net [get_bd_pins BusBlock16IN_6/Out10] [get_bd_pins AckCheckerConcept_10/line]
connect_bd_net [get_bd_pins BusBlock16IN_6/Out11] [get_bd_pins AckCheckerConcept_11/line]
connect_bd_net [get_bd_pins BusBlock16IN_6/Out12] [get_bd_pins AckCheckerConcept_12/line]
connect_bd_net [get_bd_pins BusBlock16IN_6/Out13] [get_bd_pins AckCheckerConcept_13/line]
connect_bd_net [get_bd_pins BusBlock16IN_6/Out14] [get_bd_pins AckCheckerConcept_14/line]
connect_bd_net [get_bd_pins BusBlock16IN_6/Out15] [get_bd_pins AckCheckerConcept_15/line]
connect_bd_net [get_bd_pins BusBlock16IN_7/Out0] [get_bd_pins AckCheckerConcept_16/line]
connect_bd_net [get_bd_pins BusBlock16IN_7/Out1] [get_bd_pins AckCheckerConcept_17/line]
connect_bd_net [get_bd_pins BusBlock16IN_7/Out2] [get_bd_pins AckCheckerConcept_18/line]
connect_bd_net [get_bd_pins BusBlock16IN_7/Out3] [get_bd_pins AckCheckerConcept_19/line]
connect_bd_net [get_bd_pins BusBlock16IN_7/Out4] [get_bd_pins AckCheckerConcept_20/line]
connect_bd_net [get_bd_pins BusBlock16IN_7/Out5] [get_bd_pins AckCheckerConcept_21/line]
connect_bd_net [get_bd_pins BusBlock16IN_7/Out6] [get_bd_pins AckCheckerConcept_22/line]
connect_bd_net [get_bd_pins BusBlock16IN_7/Out7] [get_bd_pins AckCheckerConcept_23/line]
connect_bd_net [get_bd_pins BusBlock16IN_7/Out8] [get_bd_pins AckCheckerConcept_24/line]
connect_bd_net [get_bd_pins BusBlock16IN_7/Out9] [get_bd_pins AckCheckerConcept_25/line]
connect_bd_net [get_bd_pins BusBlock16IN_7/Out10] [get_bd_pins AckCheckerConcept_26/line]
connect_bd_net [get_bd_pins BusBlock16IN_7/Out11] [get_bd_pins AckCheckerConcept_27/line]
connect_bd_net [get_bd_pins BusBlock16IN_7/Out12] [get_bd_pins AckCheckerConcept_28/line]
connect_bd_net [get_bd_pins BusBlock16IN_7/Out13] [get_bd_pins AckCheckerConcept_29/line]
connect_bd_net [get_bd_pins BusBlock16IN_7/Out14] [get_bd_pins AckCheckerConcept_30/line]
connect_bd_net [get_bd_pins BusBlock16IN_7/Out15] [get_bd_pins AckCheckerConcept_31/line]
connect_bd_net -net TransmitterGroup0_1 [get_bd_ports TransmitterGroup0] [get_bd_pins BusBlock16IN_6/Bus_16IN]
connect_bd_net -net TransmitterGroup1_1 [get_bd_ports TransmitterGroup1] [get_bd_pins BusBlock16IN_7/Bus_16IN]

validate_bd_design
save_bd_design
